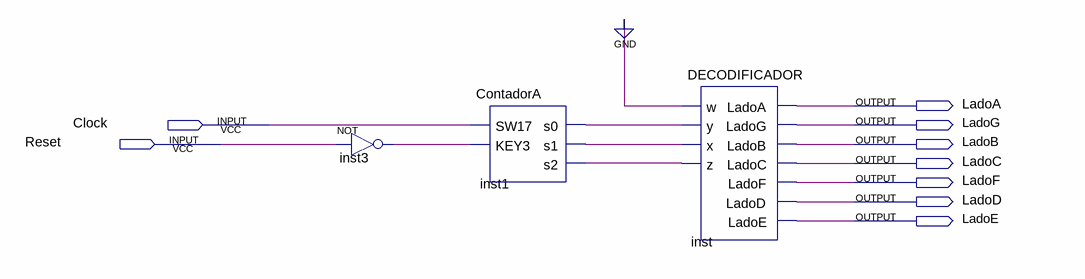
[diagram p0: schematic sheet]
// Quartus schematic Exe1.bdf as structural Verilog: 3 symbols, 9 pins
module Exe1 (
  input  Clock,
  input  Reset,
  output LadoA,
  output LadoG,
  output LadoB,
  output LadoC,
  output LadoF,
  output LadoD,
  output LadoE
);

  wire inst1_s0, inst1_s1, inst1_s2, inst3_out;

  not inst3 (inst3_out, Reset);
  ContadorA inst1 (.SW17(Clock), .KEY3(inst3_out), .s0(inst1_s0), .s1(inst1_s1), .s2(inst1_s2));
  DECODIFICADOR inst (
    .w(1'b0), .y(inst1_s0), .x(inst1_s1), .z(inst1_s2), .LadoA(LadoA), .LadoG(LadoG), .LadoB(LadoB),
    .LadoC(LadoC), .LadoF(LadoF), .LadoD(LadoD), .LadoE(LadoE));
endmodule
